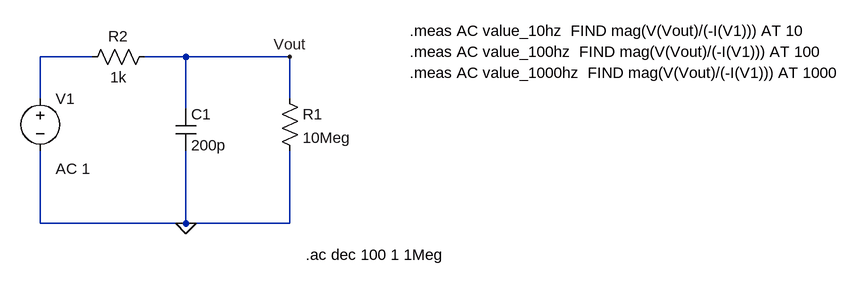
[diagram p0: schematic cable_ceiling.asc]
cable_ceiling.asc, the LTspice schematic file:
Version 4.1
SHEET 1 1296 680
WIRE 80 48 0 48
WIRE 224 48 160 48
WIRE 384 48 224 48
WIRE 0 112 0 48
WIRE 384 112 384 48
WIRE 224 128 224 48
WIRE 0 304 0 192
WIRE 224 304 224 192
WIRE 224 304 0 304
WIRE 384 304 384 192
WIRE 384 304 224 304
FLAG 384 48 Vout
FLAG 224 304 0
SYMBOL voltage 0 96 R0
WINDOW 123 24 124 Left 2
WINDOW 39 0 0 Left 0
SYMATTR InstName V1
SYMATTR Value ""
SYMATTR Value2 AC 1
SYMBOL cap 208 128 R0
SYMATTR InstName C1
SYMATTR Value 200p
SYMBOL res 368 96 R0
SYMATTR InstName R1
SYMATTR Value 10Meg
SYMBOL res 176 32 R90
WINDOW 0 0 56 VBottom 2
WINDOW 3 32 56 VTop 2
SYMATTR InstName R2
SYMATTR Value 1k
TEXT 408 352 Left 2 !.ac dec 100 1 1Meg
TEXT 568 8 Left 2 !.meas AC value_10hz  FIND mag(V(Vout)/(-I(V1))) AT 10
TEXT 568 40 Left 2 !.meas AC value_100hz  FIND mag(V(Vout)/(-I(V1))) AT 100
TEXT 568 72 Left 2 !.meas AC value_1000hz  FIND mag(V(Vout)/(-I(V1))) AT 1000

The netlist it stands for:
* cable_ceiling.asc
V1 N001 0 AC 1
C1 Vout 0 200p
R1 Vout 0 10Meg
R2 Vout N001 1k
.ac dec 100 1 1Meg
.meas AC value_10hz  FIND mag(V(Vout)/(-I(V1))) AT 10
.meas AC value_100hz  FIND mag(V(Vout)/(-I(V1))) AT 100
.meas AC value_1000hz  FIND mag(V(Vout)/(-I(V1))) AT 1000
.backanno
.end